# EAGLE schematic MyoMain (EAGLE 9.1.1)
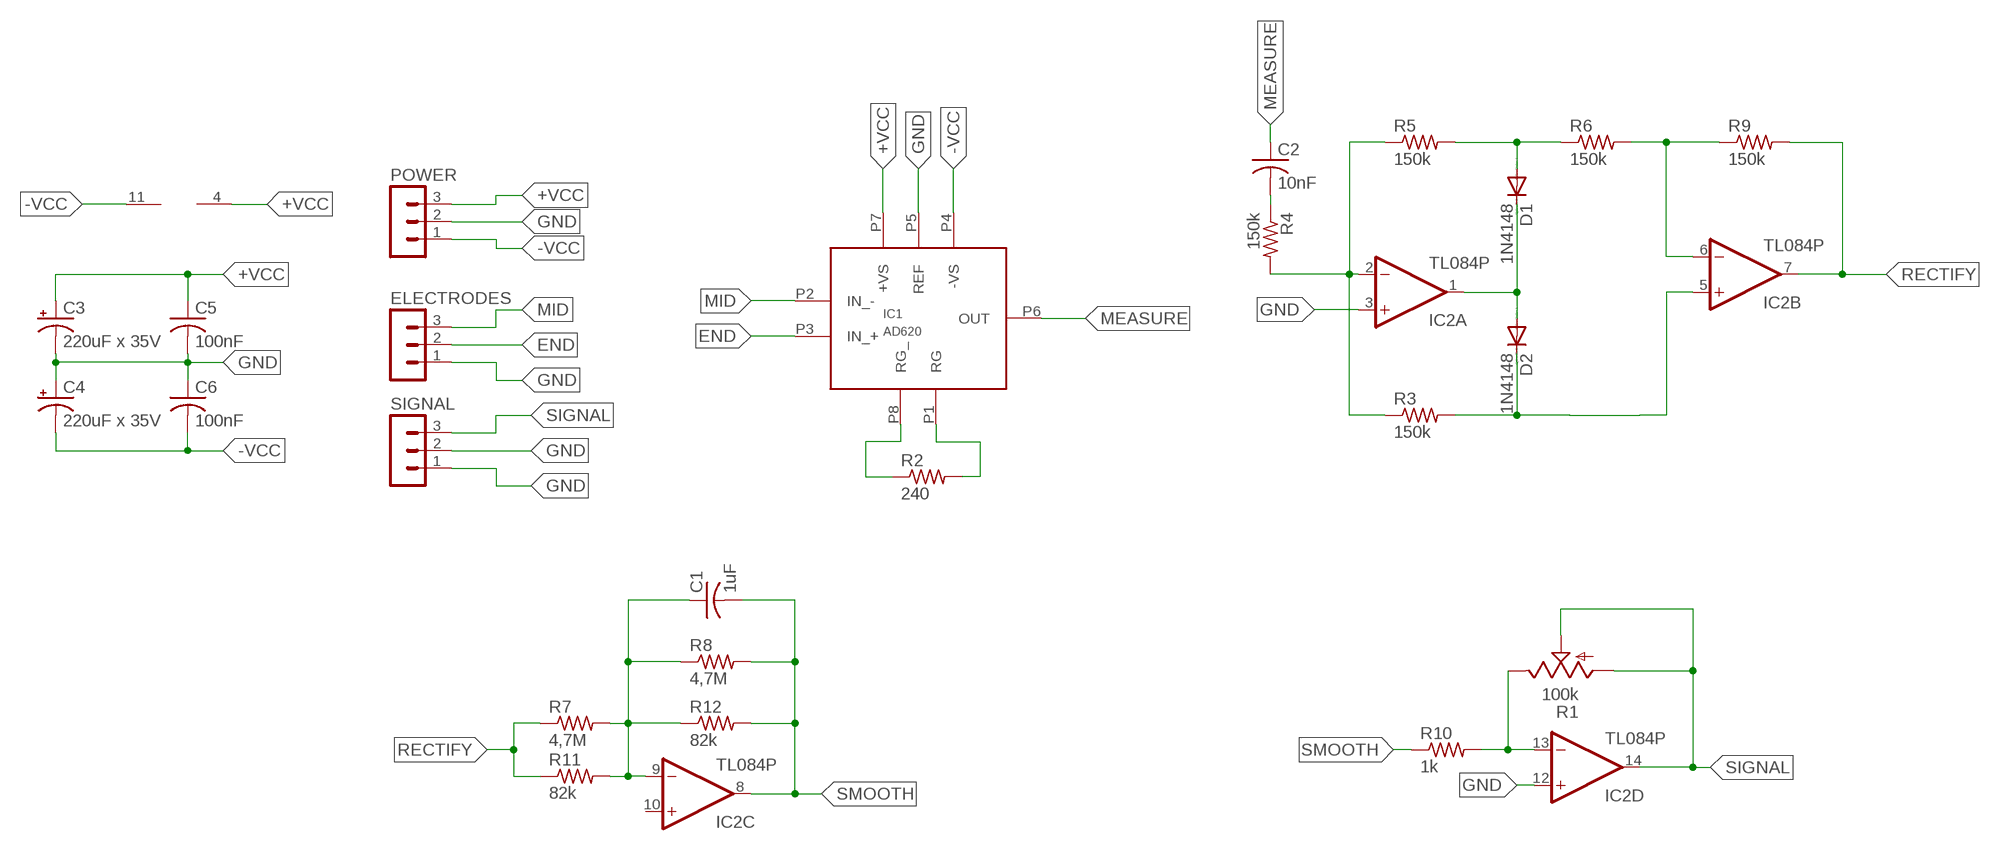
[diagram p0: schematic, sheet 1]

## Parts
C1  1uF  C-US025-025X050  [C025-025X050]
C2  10nF  C-US025-025X050  [C025-025X050]
C3  220uF x 35V  CPOL-USE3.5-10  [E3,5-10]
C4  220uF x 35V  CPOL-USE3.5-10  [E3,5-10]
C5  100nF  C-US025-025X050  [C025-025X050]
C6  100nF  C-US025-025X050  [C025-025X050]
D1  1N4148  1N4148DO35-10  [DO35-10]
D2  1N4148  1N4148DO35-10  [DO35-10]
ELECTRODES  MA03-1  [MA03-1]
IC1  AD620  [DIL8]
IC2  TL084P  [DIL14]
POWER  MA03-1  [MA03-1]
R1  100k  TRIM_US-S64W  [S64W]
R2  240  R-US_0207/10  [0207/10]
R3  150k  R-US_0207/10  [0207/10]
R4  150k  R-US_0207/10  [0207/10]
R5  150k  R-US_0207/10  [0207/10]
R6  150k  R-US_0207/10  [0207/10]
R7  4,7M  R-US_0207/10  [0207/10]
R8  4,7M  R-US_0207/10  [0207/10]
R9  150k  R-US_0207/10  [0207/10]
R10  1k  R-US_0207/10  [0207/10]
R11  82k  R-US_0207/10  [0207/10]
R12  82k  R-US_0207/10  [0207/10]
SIGNAL  MA03-1  [MA03-1]

## Nets
+VCC: C3.+ C5.1 IC1.P7(+VS) IC2.4(P:V+) POWER.3
-VCC: C4.- C6.2 IC1.P4(-VS) IC2.11(P:V-) POWER.1
END: ELECTRODES.2 IC1.P3(IN_+)
GND: C3.- C4.+ C5.2 C6.1 ELECTRODES.1 IC1.P5(REF) IC2.3(A:+IN) IC2.12(D:+IN) POWER.2 SIGNAL.1 SIGNAL.2
MEASURE: C2.1 IC1.P6(OUT)
MID: ELECTRODES.3 IC1.P2(IN_-)
N$1: IC1.P8(RG_) R2.1
N$2: IC1.P1(RG) R2.2
N$3: C2.2 R4.1
N$5: IC2.2(A:-IN) R3.1 R4.2 R5.1
N$6: D2.C IC2.5(B:+IN) R3.2
N$7: D1.C D2.A IC2.1(A:OUT)
N$8: D1.A R5.2 R6.1
N$9: IC2.6(B:-IN) R6.2 R9.1
N$10: C1.1 IC2.9(C:-IN) R7.2 R8.1 R11.2 R12.1
N$11: IC2.13(D:-IN) R1.E R10.2
RECTIFY: IC2.7(B:OUT) R7.1 R9.2 R11.1
SIGNAL: IC2.14(D:OUT) R1.A R1.S SIGNAL.3
SMOOTH: C1.2 IC2.8(C:OUT) R8.2 R10.1 R12.2
Unconnected: IC2.10(C:+IN)

## Library data of the parts
C1 C2 C5 C6 = rcl:C-US: CAPACITOR, American symbol; SPICEPREFIX: C
C3 C4 = rcl:CPOL-US: POLARIZED CAPACITOR, American symbol; SPICEPREFIX: C
D1 D2 = diode:1N4148: DIODE high speed (Philips)
ELECTRODES POWER SIGNAL = con-lstb:MA03-1: PIN HEADER; OC_FARNELL: unknown; OC_NEWARK: unknown
IC1 = ad620:AD620
IC2 = linear:TL084: OP AMP
R1 = pot:TRIM_US-: POTENTIOMETER
R2-R12 = resistor:R-US_: RESISTOR, American symbol